# Altium schematic sheet Sheet2.SchDoc
size A4; SheetNumber: 1; SheetTotal: 1
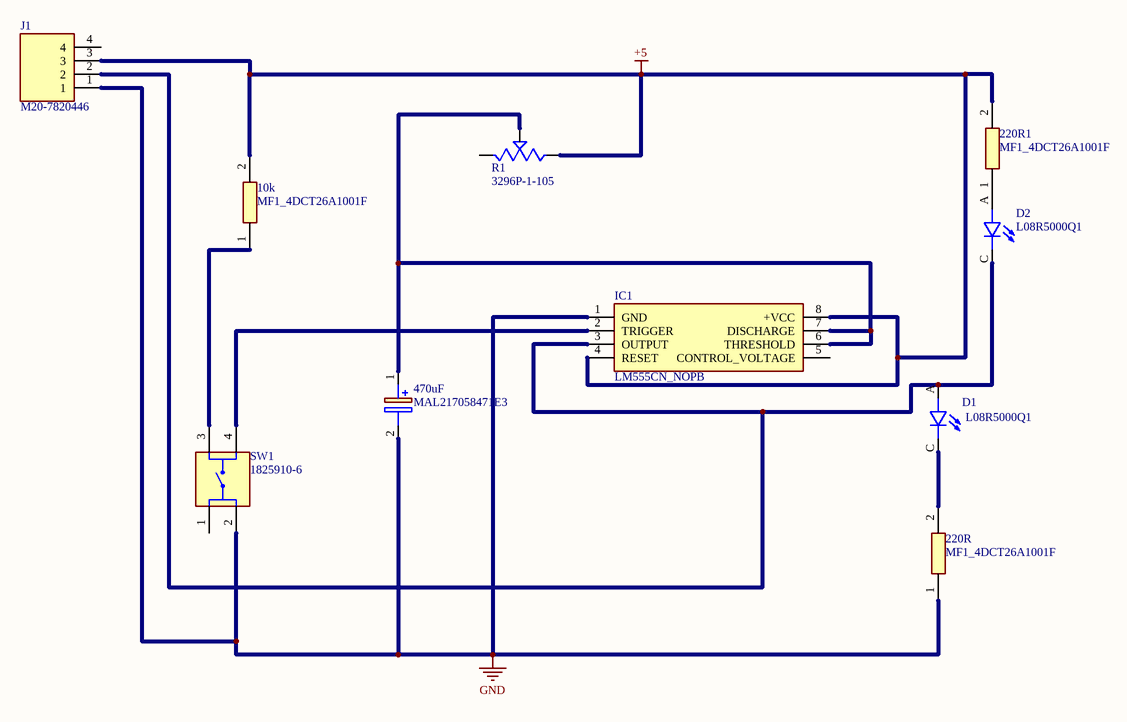
[diagram p0: Sheet2.SchDoc]

## Parts
10k  MF1_4DCT26A1001F  [RESAD1630W60L710D230]
220R  MF1_4DCT26A1001F  [RESAD1630W60L710D230]
220R1  MF1_4DCT26A1001F  [RESAD1630W60L710D230]
470uF  MAL217058471E3  [CAPPRD500W60D1300H2700]
D1  L08R5000Q1  [LEDRD254W57D500H1070]
D2  L08R5000Q1  [LEDRD254W57D500H1070]
IC1  LM555CN_NOPB  [DIP794W53P254L959H508Q8N]
J1  M20-7820446  [RHDR4W70P0X254_1X4_1056X250X865P]
R1  3296P-1-105  [TRIM_3296P-1-105]
SW1  1825910-6  [SW_1825910-6-4]

## Nets
+5: 10k.2 220R1.2 IC1.4(RESET) IC1.8(+VCC) J1.3 R1.1(CCW)
GND: 220R.1 470uF.2(-) IC1.1(GND) J1.1 SW1.2
Net10k_1: 10k.1 SW1.3
Net220R1_1: 220R1.1 D2.A
Net220R_2: 220R.2 D1.C
Net470uF_1: 470uF.1(+) IC1.6(THRESHOLD) IC1.7(DISCHARGE) R1.2(WIPER)
NetD1_A: D1.A D2.C IC1.3(OUTPUT) J1.2
NetIC1_2: IC1.2(TRIGGER) SW1.4

Not connected (* = marked no-connect by the designer): IC1 5(CONTROL_VOLTAGE); J1 4; R1 3(CW); SW1 1

## Library data of the parts
10k 220R 220R1 = MF1_4DCT26A1001F: Resistor; Manufacturer_Name: KOA Speer; Manufacturer_Part_Number: MF1/4DCT26A1001F; Datasheet Link: https://componentsearchengine.com/Datasheets/1/MF1_4DCT26A1001F.pdf; Mouser Part Number: 660-MF1/4DCT26A1001F; Mouser Price/Stock: https://www.mouser.co.uk/ProductDetail/KOA-Speer/MF1-4DCT26A1001F?qs=wVGympPcmnD9Oav1Pii0SQ%3D%3D
470uF = MAL217058471E3: Capacitor Polarised; Manufacturer_Name: Vishay; Datasheet Link: https://www.mouser.com/datasheet/2/177/186_187-948805.pdf; Height: 27mm; Manufacturer_Part_Number: MAL217058471E3; Mouser Part Number: 594-MAL217058471E3; Mouser Price/Stock: https://www.mouser.co.uk/ProductDetail/Vishay-BC-Components/MAL217058471E3?qs=eP2BKZSCXI7oGPzw3Bg59Q%3D%3D
D1 D2 = L08R5000Q1: LED, 5MM, ORANGE; LED / Lamp Size: 5mm / T-1 3/4; LED Colour: Orange; Typ Luminous Intensity: 4.3mcd; Viewing Angle: ...; MF: LED Technology; Value: *; SnapEDA_Link: https://www.snapeda.com/parts/L08R5000Q1/LED+Technology/view-part/?ref=snap; MP: L08R5000Q1; Check_prices: https://www.snapeda.com/parts/L08R5000Q1/LED+Technology/view-part/?ref=eda; Availability: In Stock; Price: None; Package: None
IC1 = LM555CN_NOPB: Integrated Circuit; Manufacturer_Name: Texas Instruments; Manufacturer_Part_Number: LM555CN/NOPB; Datasheet Link: https://datasheet.datasheetarchive.com/originals/distributors/Datasheets-SFU2/DSASFU100035550.pdf; Height: 5.08mm; Mouser Part Number: 926-LM555CN/NOPB; Mouser Price/Stock: https://www.mouser.co.uk/ProductDetail/Texas-Instruments/LM555CN-NOPB?qs=QbsRYf82W3GjZpQL%2FakZOg%3D%3D; Arrow Part Number: LM555CN/NOPB; Arrow Price/Stock: https://www.arrow.com/en/products/lm555cnnopb/texas-instruments?region=nac
J1 = M20-7820446: Connector; Manufacturer_Name: Harwin; Datasheet Link: https://cdn.harwin.com/pdfs/M20-782.pdf; Height: 8.65mm; Manufacturer_Part_Number: M20-7820446; Mouser Part Number: 855-M20-7820446; Mouser Price/Stock: https://www.mouser.co.uk/ProductDetail/Harwin/M20-7820446?qs=vF78I%252BjhbY8%252Bno0H8mp9XA%3D%3D
R1 = 3296P-1-105: 1 kOhms 0.5W, 1/2W PC Pins Through Hole Trimmer Potentiometer Cermet 25 Turn Side Adjustment; MP: altium_native_batch; Package: None; Price: None; Value: *; Availability: Unavailable
SW1 = 1825910-6: Switch Push Button OFF (ON) SPST Round Button 0.05A 24VDC Momentary Contact PC Pins Thru-Hole; MF: TE Connectivity; Value: *; MP: 1825910-6; Package: None; Check_prices: https://www.snapeda.com/parts/1825910-6/TE+Connectivity+ALCOSWITCH+Switches/view-part/?ref=eda; SnapEDA_Link: https://www.snapeda.com/parts/1825910-6/TE+Connectivity+ALCOSWITCH+Switches/view-part/?ref=snap; Digi-Key_Part_Number: 450-1650-ND; Purchase-URL: https://pricing.snapeda.com/search/part/1825910-6/?ref=eda